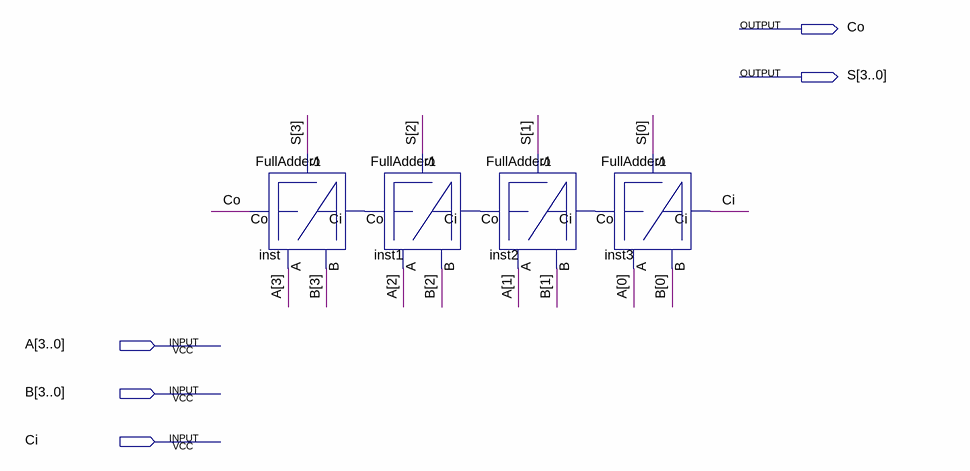
[diagram p0: schematic sheet]
// Quartus schematic FullAdder4.bdf as structural Verilog: 4 symbols, 5 pins
module FullAdder4 (
  input  [3:0] A,
  input  [3:0] B,
  input  Ci,
  output Co,
  output [3:0] S
);

  wire inst1_co, inst2_co, inst3_co;

  FullAdder1 inst (.Ci(inst1_co), .B(B[3]), .A(A[3]), .S(S[3]), .Co(Co));
  FullAdder1 inst1 (.Ci(inst2_co), .B(B[2]), .A(A[2]), .S(S[2]), .Co(inst1_co));
  FullAdder1 inst2 (.Ci(inst3_co), .B(B[1]), .A(A[1]), .S(S[1]), .Co(inst2_co));
  FullAdder1 inst3 (.Ci(Ci), .B(B[0]), .A(A[0]), .S(S[0]), .Co(inst3_co));
endmodule
